# EAGLE design RAMPS_1-41 (EAGLE 6.3)
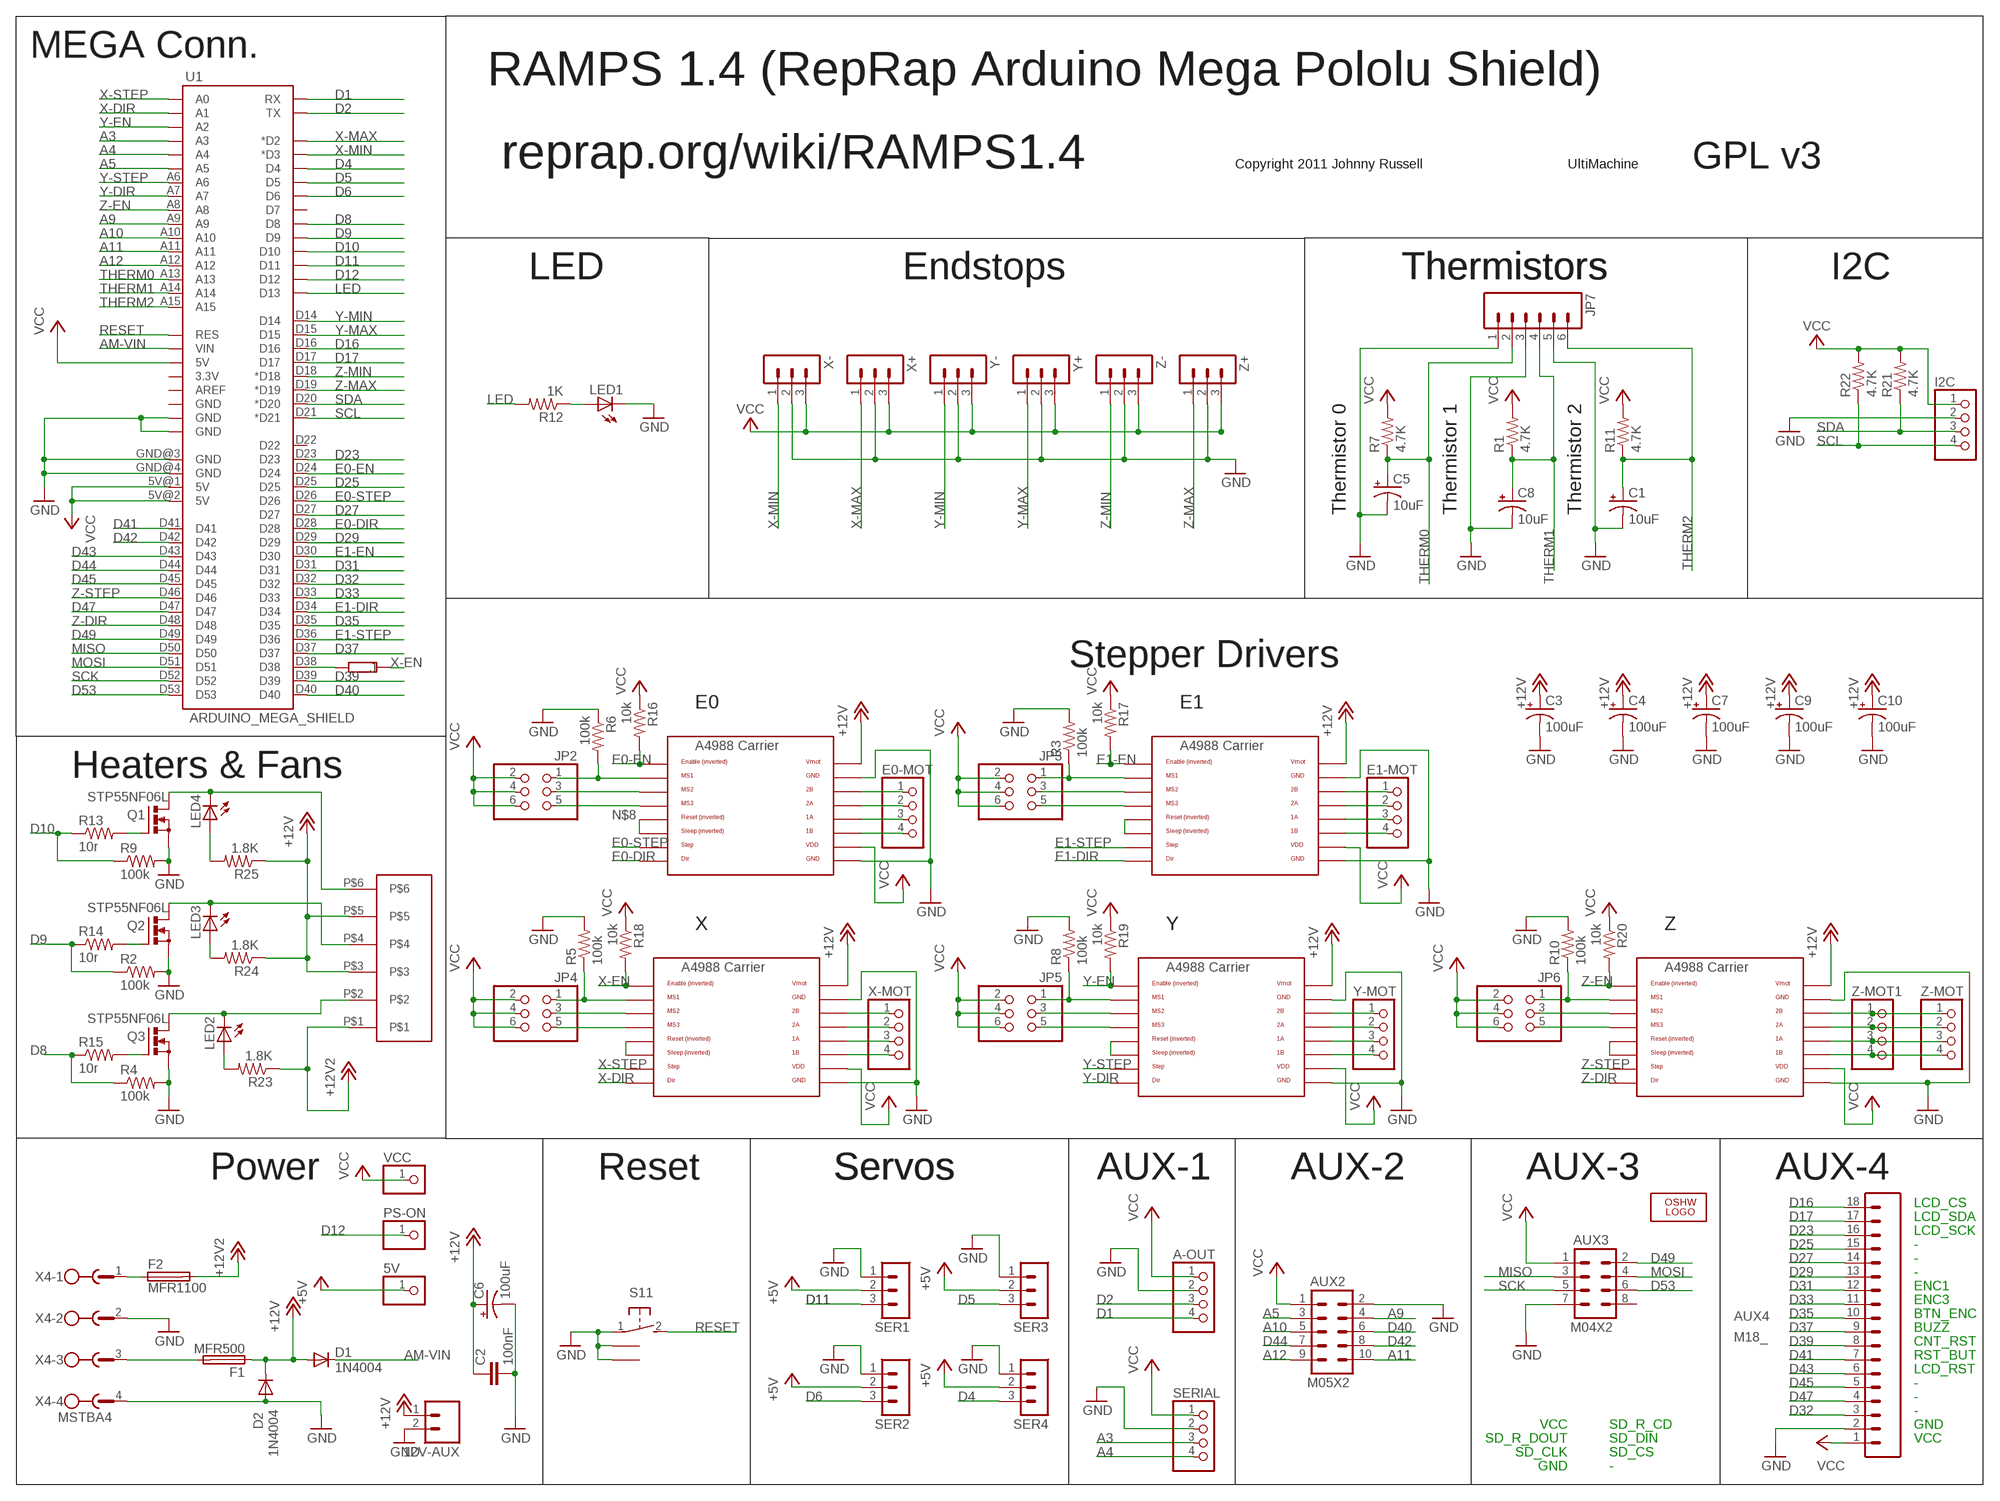
[diagram p0: schematic, sheet 1]

## Parts
5V  PINHD-1X1  [1X01]
12V-AUX  M02PTH  [1X02]
A-OUT  PINHD-1X4  [1X04]
AUX2  M05X2  [2X5]
AUX3  M04X2  [2X4]
AUX4  M18_  [1X18]
C1  10uF  CPOL-US153CLV-0405  [153CLV-0405]
C2  100nF  C-EUC0805  [C0805]
C3  100uF  CPOL-US153CLV-0605  [153CLV-0605]
C4  100uF  CPOL-US153CLV-0605  [153CLV-0605]
C5  10uF  CPOL-US153CLV-0405  [153CLV-0405]
C6  100uF  CPOL-US153CLV-0605  [153CLV-0605]
C7  100uF  CPOL-US153CLV-0605  [153CLV-0605]
C8  10uF  CPOL-US153CLV-0405  [153CLV-0405]
C9  100uF  CPOL-US153CLV-0605  [153CLV-0605]
C10  100uF  CPOL-US153CLV-0605  [153CLV-0605]
D1  1N4004  [DO41-10]
D2  1N4004  [DO41-10]
E0-MOT  PINHD-1X4  [1X04]
E1-MOT  PINHD-1X4  [1X04]
F1  MFR500  PTCFUSE  [MFR500]
F2  MFR1100  PTCFUSEMFR1100  [MFR1100]
I2C  PINHD-1X4  [1X04]
J  R-EU_R1206W  [R1206W]
JP2  PINHD-2X3  [2X03]
JP3  PINHD-2X3  [2X03]
JP4  PINHD-2X3  [2X03]
JP5  PINHD-2X3  [2X03]
JP6  PINHD-2X3  [2X03]
JP7  M06SIP  [1X06]
LED1  LEDCHIP-LED0805  [CHIP-LED0805]
LED2  LEDCHIP-LED0805  [CHIP-LED0805]
LED3  LEDCHIP-LED0805  [CHIP-LED0805]
LED4  LEDCHIP-LED0805  [CHIP-LED0805]
LOGO1  OSHW_LOGO_6MILX0100-NT  [OSHW_6X100_NOTEXT]
PS-ON  PINHD-1X1  [1X01]
Q1  STP55NF06L  IRF512  [TO220BV]
Q2  STP55NF06L  IRF512  [TO220BV]
Q3  STP55NF06L  IRF512  [TO220BV]
R1  4.7K  R-US_R0805  [R0805]
R2  100k  R-US_R0805  [R0805]
R3  100k  R-US_R0805  [R0805]
R4  100k  R-US_R0805  [R0805]
R5  100k  R-US_R0805  [R0805]
R6  100k  R-US_R0805  [R0805]
R7  4.7K  R-US_R0805  [R0805]
R8  100k  R-US_R0805  [R0805]
R9  100k  R-US_R0805  [R0805]
R10  100k  R-US_R1206W  [R1206W]
R11  4.7K  R-US_R0805  [R0805]
R12  1K  R-US_R0805  [R0805]
R13  10r  R-US_R0805  [R0805]
R14  10r  R-US_M0805  [M0805]
R15  10r  R-US_R0805  [R0805]
R16  10k  R-US_R0805  [R0805]
R17  10k  R-US_R0805  [R0805]
R18  10k  R-US_R0805  [R0805]
R19  10k  R-US_R0805  [R0805]
R20  10k  R-US_R0805  [R0805]
R21  4.7K  R-US_R0603  [R0603]
R22  4.7K  R-US_R0603  [R0603]
R23  1.8K  R-US_R0805  [R0805]
R24  1.8K  R-US_R0805  [R0805]
R25  1.8K  R-US_R0805  [R0805]
S1  31-XX  [B3F-31XX]
SER1  3PIN-HEADER  [3PIN-HEADER]
SER2  3PIN-HEADER  [3PIN-HEADER]
SER3  3PIN-HEADER  [3PIN-HEADER]
SER4  3PIN-HEADER  [3PIN-HEADER]
SERIAL  PINHD-1X4  [1X04]
U1  ARDUINO_MEGA_SHIELD  [ARDUINO_MEGA_SHIELD]
U$2  282837-6  [282837-6]
U$4E0  A4988BREAKOUT  [A4988BREAKOUT]
U$5E1  A4988BREAKOUT  [A4988BREAKOUT]
U$6X  A4988BREAKOUT  [A4988BREAKOUT]
U$7Y  A4988BREAKOUT  [A4988BREAKOUT]
VCC  PINHD-1X1  [1X01]
X4  MSTBA4  [MSTBA4]
X+  3PIN-HEADER  [3PIN-HEADER]
X-  3PIN-HEADER  [3PIN-HEADER]
X-MOT  PINHD-1X4  [1X04]
Y+  3PIN-HEADER  [3PIN-HEADER]
Y-  3PIN-HEADER  [3PIN-HEADER]
Y-MOT  PINHD-1X4  [1X04]
Z  A4988BREAKOUT  [A4988BREAKOUT]
Z+  3PIN-HEADER  [3PIN-HEADER]
Z-  3PIN-HEADER  [3PIN-HEADER]
Z-MOT  PINHD-1X4  [1X04]
Z-MOT1  PINHD-1X4  [1X04]

## Nets
+5V: 5V.1 SER1.2 SER2.2 SER3.2 SER4.2
+12V: 12V-AUX.1 C2.1 C3.+ C4.+ C6.+ C7.+ C9.+ C10.+ D1.A D2.C F1.1 R24.1 R25.1 U$2.P$3 U$2.P$5 U$4E0.VMOT U$5E1.VMOT U$6X.VMOT U$7Y.VMOT Z.VMOT
+12V2: F2.2 R23.1 U$2.P$1
A3: SERIAL.3 U1.A3
A4: SERIAL.4 U1.A4
A5: AUX2.3 U1.A5
A9: AUX2.4 U1.A9
A10: AUX2.5 U1.A10
A11: AUX2.10 U1.A11
A12: AUX2.9 U1.A12
AM-VIN: D1.C U1.VIN
D1: A-OUT.4 U1.RX
D2: A-OUT.3 U1.TX
D4: SER4.3 U1.D4
D5: SER3.3 U1.D5
D6: SER2.3 U1.D6
D8: R4.1 R15.1 U1.D8
D9: R2.1 R14.1 U1.D9
D10: R9.1 R13.1 U1.D10
D11: SER1.3 U1.D11
D12: PS-ON.1 U1.D12
D16: AUX4.18 U1.D16
D17: AUX4.17 U1.D17
D23: AUX4.16 U1.D23
D25: AUX4.15 U1.D25
D27: AUX4.14 U1.D27
D29: AUX4.13 U1.D29
D31: AUX4.12 U1.D31
D32: AUX4.3 U1.D32
D33: AUX4.11 U1.D33
D35: AUX4.10 U1.D35
D37: AUX4.9 U1.D37
D39: AUX4.8 U1.D39
D40: AUX2.6 U1.D40
D41: AUX4.7 U1.D41
D42: AUX2.8 U1.D42
D43: AUX4.6 U1.D43
D44: AUX2.7 U1.D44
D45: AUX4.5 U1.D45
D47: AUX4.4 U1.D47
D49: AUX3.2 U1.D49
D53: AUX3.6 U1.D53
E0-DIR: U1.D28 U$4E0.DIR
E0-EN: R16.2 U1.D24 U$4E0.EN
E0-STEP: U1.D26 U$4E0.STEP
E1-DIR: U1.D34 U$5E1.DIR
E1-EN: R17.2 U1.D30 U$5E1.EN
E1-STEP: U1.D36 U$5E1.STEP
GND: 12V-AUX.2 A-OUT.2 AUX2.2 AUX3.7 AUX4.2 C1.- C2.2 C3.- C4.- C5.- C6.- C7.- C8.- C9.- C10.- D2.A I2C.2 JP7.1 JP7.3 JP7.5 LED1.C Q1.S Q2.S Q3.S R2.2 R3.2 R4.2 R5.2 R6.1 R8.2 R9.2 R10.2 S1.1(1:P) S1.3 S1.4 SER1.1 SER2.1 SER3.1 SER4.1 SERIAL.2 U1.GND@0(GND) U1.GND@1(GND) U1.GND@3(GND) U1.GND@4(GND) U$4E0.GND U$4E0.GND@0(GND) U$5E1.GND U$5E1.GND@0(GND) U$6X.GND U$6X.GND@0(GND) U$7Y.GND U$7Y.GND@0(GND) X4.2 X4.4 X+.2 X-.2 Y+.2 Y-.2 Z+.2 Z-.2 Z.GND Z.GND@0(GND)
LED: R12.2 U1.D13
MISO: AUX3.3 U1.D50
MOSI: AUX3.4 U1.D51
N$1: LED3.C Q2.D U$2.P$4
N$2: J.1 U1.D38
N$3: E0-MOT.1 U$4E0.2B
N$4: E0-MOT.2 U$4E0.2A
N$5: JP2.1 R6.2 U$4E0.MS1
N$6: JP2.5 U$4E0.MS3
N$7: LED4.C Q1.D U$2.P$6
N$8: U$4E0.RST U$4E0.SLP(SLEEP)
N$9: JP2.3 U$4E0.MS2
N$10: E0-MOT.3 U$4E0.1A
N$11: E0-MOT.4 U$4E0.1B
N$12: E1-MOT.1 U$5E1.2B
N$13: E1-MOT.2 U$5E1.2A
N$14: JP4.1 R5.1 U$6X.MS1
N$15: JP4.3 U$6X.MS2
N$16: E1-MOT.3 U$5E1.1A
N$17: JP5.3 U$7Y.MS2
N$18: E1-MOT.4 U$5E1.1B
N$19: JP4.5 U$6X.MS3
N$20: U$6X.RST U$6X.SLP(SLEEP)
N$21: U$6X.2B X-MOT.1
N$22: U$6X.2A X-MOT.2
N$23: U$7Y.RST U$7Y.SLP(SLEEP)
N$24: U$5E1.RST U$5E1.SLP(SLEEP)
N$25: JP3.1 R3.1 U$5E1.MS1
N$26: U$6X.1A X-MOT.3
N$27: U$6X.1B X-MOT.4
N$28: U$7Y.2B Y-MOT.1
N$29: U$7Y.2A Y-MOT.2
N$30: U$7Y.1A Y-MOT.3
N$31: JP5.5 U$7Y.MS3
N$32: LED2.A R23.2
N$33: JP5.1 R8.1 U$7Y.MS1
N$34: JP3.5 U$5E1.MS3
N$35: JP3.3 U$5E1.MS2
N$36: U$7Y.1B Y-MOT.4
N$37: JP6.3 Z.MS2
N$38: Z.RST Z.SLP(SLEEP)
N$39: JP6.5 Z.MS3
N$40: JP6.1 R10.1 Z.MS1
N$41: Z-MOT1.1 Z-MOT.1 Z.2B
N$42: Z-MOT1.2 Z-MOT.2 Z.2A
N$43: Z-MOT1.3 Z-MOT.3 Z.1A
N$44: Z-MOT1.4 Z-MOT.4 Z.1B
N$45: LED3.A R24.2
N$46: LED1.A R12.1
N$47: Q2.G R14.2
N$48: Q1.G R13.2
N$49: Q3.G R15.2
N$50: LED4.A R25.2
N$51: LED2.C Q3.D U$2.P$2
N$53: F2.1 X4.1
N$54: F1.2 X4.3
RESET: S1.2(1:S) U1.RES
SCK: AUX3.5 U1.D52
SCL: I2C.4 R22.1 U1.D21(*D21)
SDA: I2C.3 R21.1 U1.D20(*D20)
THERM0: C5.+ JP7.2 R7.1 U1.A13
THERM1: C8.+ JP7.4 R1.1 U1.A14
THERM2: C1.+ JP7.6 R11.1 U1.A15
VCC: A-OUT.1 AUX2.1 AUX3.1 AUX4.1 I2C.1 JP2.2 JP2.4 JP2.6 JP3.2 JP3.4 JP3.6 JP4.2 JP4.4 JP4.6 JP5.2 JP5.4 JP5.6 JP6.2 JP6.4 JP6.6 R1.2 R7.2 R11.2 R16.1 R17.1 R18.1 R19.1 R20.1 R21.2 R22.2 SERIAL.1 U1.5V@0(5V) U1.5V@1(5V) U1.5V@2(5V) U$4E0.VDD U$5E1.VDD U$6X.VDD U$7Y.VDD VCC.1 X+.3 X-.3 Y+.3 Y-.3 Z+.3 Z-.3 Z.VDD
X-DIR: U1.A1 U$6X.DIR
X-EN: J.2 R18.2 U$6X.EN
X-MAX: U1.D2(*D2) X+.1
X-MIN: U1.D3(*D3) X-.1
X-STEP: U1.A0 U$6X.STEP
Y-DIR: U1.A7 U$7Y.DIR
Y-EN: R19.2 U1.A2 U$7Y.EN
Y-MAX: U1.D15 Y+.1
Y-MIN: U1.D14 Y-.1
Y-STEP: U1.A6 U$7Y.STEP
Z-DIR: U1.D48 Z.DIR
Z-EN: R20.2 U1.A8 Z.EN
Z-MAX: U1.D19(*D19) Z+.1
Z-MIN: U1.D18(*D18) Z-.1
Z-STEP: U1.D46 Z.STEP
Unconnected: AUX3.8 U1.3.3V U1.AREF U1.D7 U1.D22 U1.GND@2(GND)

## Notes on the sheet
- MEGA Conn.
- RAMPS 1.4 (RepRap Arduino Mega Pololu Shield)
- reprap.org/wiki/RAMPS1.4 | Copyright 2011 Johnny Russell | UltiMachine | GPL v3
- LED | Endstops | Thermistors | Thermistors | I2C
- Thermistor 0 | Thermistor 1 | Thermistor 2
- Stepper Drivers
- E0 | E1
- Heaters & Fans
- X | Y | Z
- Power | Reset | Servos | Servos | AUX-1 | AUX-2 | AUX-3 | AUX-4
- LCD_CS
- LCD_SDA
- LCD_SCK
- -
- -
- -
- ENC1
- ENC3
- BTN_ENC
- BUZZ
- CNT_RST
- RST_BUT
- LCD_RST
- -
- -
- -
- VCC | SD_R_CD | GND
- SD_R_DOUT | SD_DIN | VCC
- SD_CLK | SD_CS
- GND | -

## Library data of the parts
5V PS-ON VCC = adafruit:PINHD-1X1: Pin header 1x1 for 0.1" spacing With round pins
12V-AUX = SparkFun:M02: Header 2 Standard 2-pin 0.1" header. Use with straight break away headers (SKU : PRT-00116), right angle break away headers (PRT-00553), swiss pins (PRT-00743), machine pins (PRT-00117), and female headers (PRT-00115). Molex polarized connector foot print use with SKU : PRT-08233 with associated crimp pins and housings.
A-OUT E0-MOT E1-MOT I2C SERIAL X-MOT Y-MOT Z-MOT Z-MOT1 = RepRapjr:PINHD-1X4: PIN HEADER
AUX2 = RepRapjr_o:M05X2
AUX3 = SparkFun:M04X2
AUX4 = SparkFun:M18
C1 C3-C10 = adafruit:CPOL-US: POLARIZED CAPACITOR, American symbol
C2 = resistor:C-EU: CAPACITOR, European symbol
D1 D2 = diode:1N4004: DIODE general purpose rectifier, 1 A
F1 F2 = RepRapjr:PTCFUSE: LITTLEFUSE Picofuse/slow Littlefuse
J = rcl:R-EU_: RESISTOR, European symbol
JP2-JP6 = eagle-ramps:PINHD-2X3: PIN HEADER
JP7 = SparkFun:M06
LED1-LED4 = led:LED: LED OSRAM: - CHIPLED LG R971, LG N971, LY N971, LG Q971, LY Q971, LO R971, LY R971 LH N974, LH R974 LS Q976, LO Q976, LY Q976 LO Q996 - Hyper CHIPLED LW Q18S LB Q993, LB Q99A, LB R99A - SideLED LS A670, LO A670, LY A670, LG A670, LP A670 LB A673, LV A673, LT A673, LW A673 LH A674 LY A675 LS A676, LA A676, LO A676, LY A676, LW A676 LS A679, LY A679, LG A679 - Hyper Micro SIDELED® LS Y876, LA Y876, LO Y876, LY Y876 LT Y87S - SmartLED LW L88C, LW L88S LB L89C, LB L89S, LG L890 LS L89K, LO L89K, LY L89K LS L896, LA L896, LO L896, LY L896 - TOPLED LS T670, LO T670, LY T670, LG T670, LP T670 LSG T670, LSP T670, LSY T670, LOP T670, LYG T670 LG T671, LOG T671, LSG T671 LB T673, LV T673, LT T673, LW T673 LH T674 LS T676, LA T676, LO T676, LY T676, LB T676, LH T676, LSB T676, LW T676 LB T67C, LV T67C, LT T67C, LS T67K, LO T67K, LY T67K, LW E67C LS E67B, LA E67B, LO E67B, LY E67B, LB E67C, LV E67C, LT E67C LW T67C LS T679, LY T679, LG T679 LS T770, LO T770, LY T770, LG T770, LP T770 LB T773, LV T773, LT T773, LW T773 LH T774 LS E675, LA E675, LY E675, LS T675 LS T776, LA T776, LO T776, LY T776, LB T776 LHGB T686 LT T68C, LB T68C - Hyper Mini TOPLED® LB M676 - Mini TOPLED Santana® LG M470 LS M47K, LO M47K, LY M47K Source: http://www.osram.convergy.de LUXEON: - LUMILED® LXK2-PW12-R00, LXK2-PW12-S00, LXK2-PW14-U00, LXK2-PW14-V00 LXK2-PM12-R00, LXK2-PM12-S00, LXK2-PM14-U00 LXK2-PE12-Q00, LXK2-PE12-R00, LXK2-PE12-S00, LXK2-PE14-T00, LXK2-PE14-U00 LXK2-PB12-K00, LXK2-PB12-L00, LXK2-PB12-M00, LXK2-PB14-N00, LXK2-PB14-P00, LXK2-PB14-Q00 LXK2-PR12-L00, LXK2-PR12-M00, LXK2-PR14-Q00, LXK2-PR14-R00 LXK2-PD12-Q00, LXK2-PD12-R00, LXK2-PD12-S00 LXK2-PH12-R00, LXK2-PH12-S00 LXK2-PL12-P00, LXK2-PL12-Q00, LXK2-PL12-R00 Source: www.luxeon.com KINGBRIGHT: KA-3528ASYC Source: www.kingbright.com
LOGO1 = OSHW:OSHW_LOGO_6MIL
Q1-Q3 = transistor-power:IRF512: N-CHANNEL MOS FET
R1-R12 R16-R25 = adafruit:R-US_: RESISTOR, American symbol
R13-R15 = resistor:R-US_: RESISTOR, American symbol
S1 = eagle-ramps:31-XX: OMRON SWITCH; MPN: B3F-3100; OC_FARNELL: 959704; OC_NEWARK: 36M3582
SER1-SER4 X+ X- Y+ Y- Z+ Z- = ultimachine:3PIN-HEADER: PIN HEADER
U1 = RepRapjr_o:ARDUINO_MEGA_SHIELD
U$2 = RepRapjr:282837-6
U$4E0 = e0:A4988BREAKOUT
U$5E1 = e1:A4988BREAKOUT
U$6X = x:A4988BREAKOUT
U$7Y = y:A4988BREAKOUT
X4 = con-phoenix-508:MSTBA4: PHOENIX
Z = z:A4988BREAKOUT

## Board
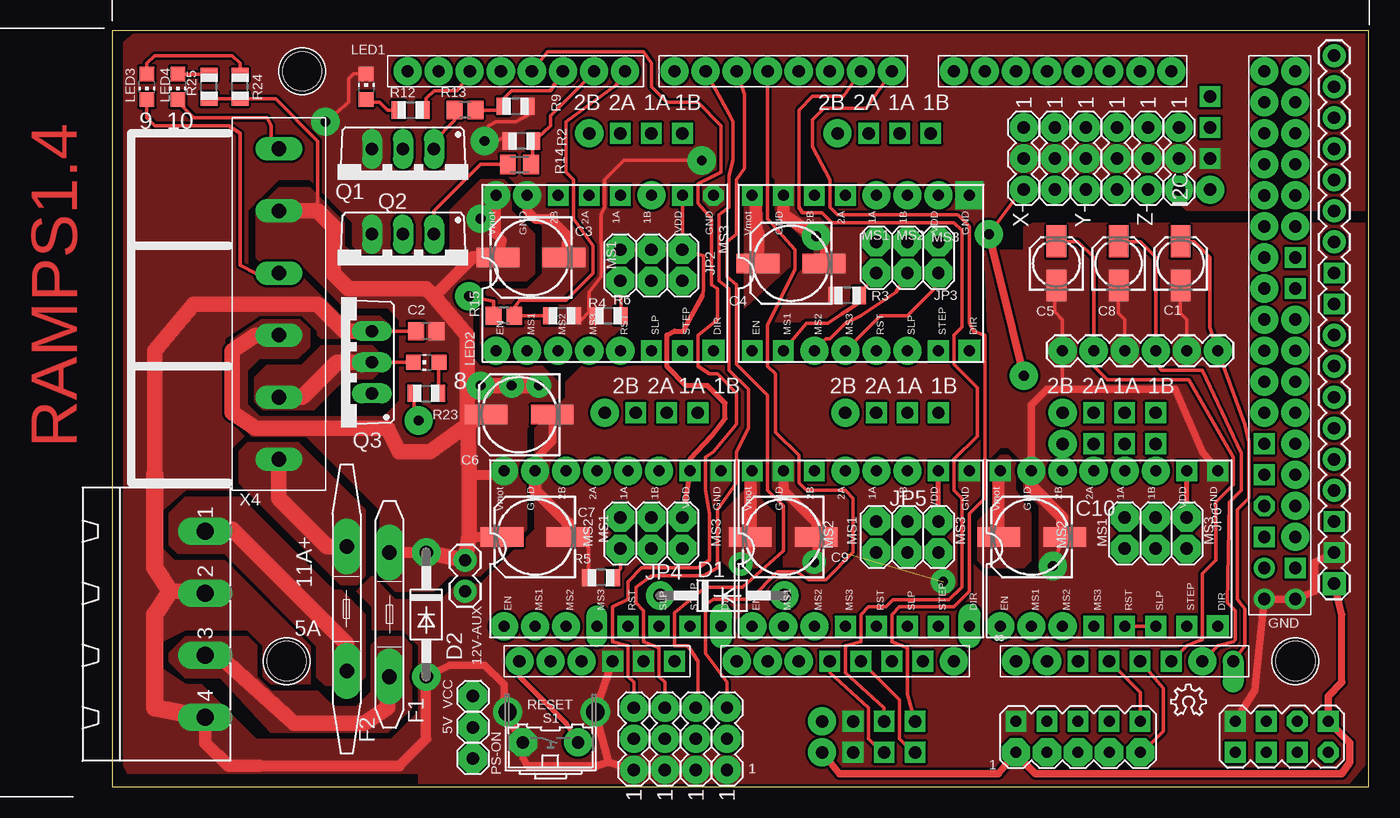
[diagram p1: board, top side]
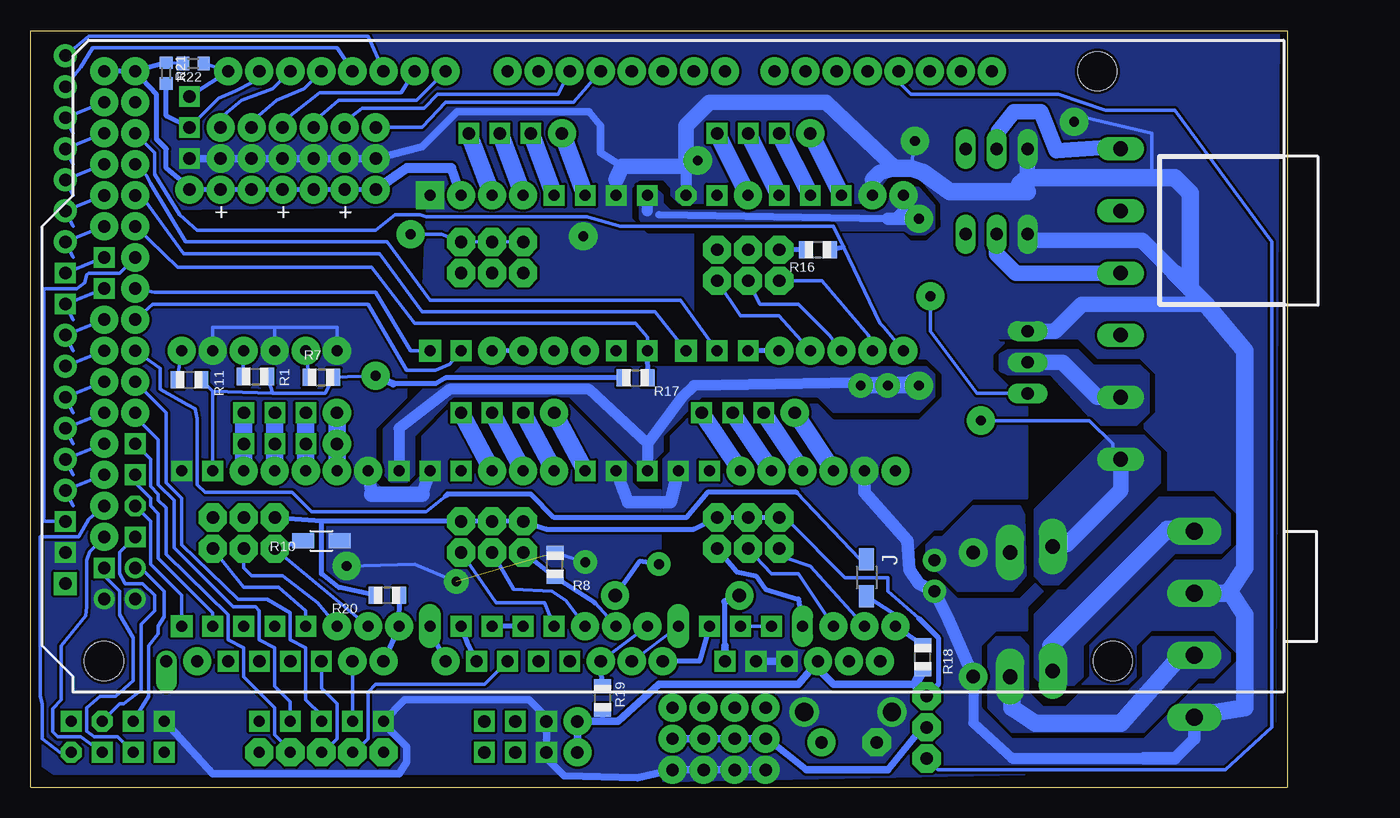
[diagram p2: board, bottom side, seen from below]

Size 102.86 x 61.9 mm. Coordinates in mm from the lower left corner, seen from the top.
Outline: 102.86,0 102.86,61.9 0,61.9 0,0 102.86,0
Copper layers (1*16): Top 0.035mm / dielectric 2mm / Bottom 0.035mm
Design rules "DesignRules": minimum track width 8mil, minimum drill 24mil, track to track 0.2mm, track to pad 0.2mm, pad to pad 8mil, via to via 8mil, smd to smd 8mil, copper to edge 10mil, drill to drill 8mil, minimum pad ring 0.3mm, minimum via ring 8mil, stop-mask expansion 4mil, vias tented up to drill 0mil, thermal gap 10mil

### Footprints (pad centres in the part's own frame; a part is rotated, then mirrored left to right if it is on the bottom)
1X01 = drill 1.016 pad 2.3 octagon: 1 0,0
1X02 = drill 1.016 pad 1.88: 1 0,0; 2 2.54,0
1X04 = drill 1.016 pad 2.3: 1 -2.54,0 | drill 1.016 pad 1.7 square: 2 0,0; 3 2.54,0; 4 5.08,0
2X5 = drill 0.9 pad 2.3 octagon: 1 -3.81,-1.27; 3 -1.27,-1.27; 5 1.27,-1.27; 7 3.81,-1.27; 9 6.35,-1.27 | drill 0.9 pad 1.7 square: 2 -3.81,1.27; 4 -1.27,1.27; 6 1.27,1.27; 8 3.81,1.27; 10 6.35,1.27
2X4 = drill 0.9 pad 1.7 square: 1 -3.81,-1.27; 4 -1.27,1.27; 5 1.27,-1.27; 6 1.27,1.27; 7 3.81,-1.27; 8 3.81,1.27 | drill 0.9 pad 1.7 octagon: 2 -3.81,1.27; 3 -1.27,-1.27
1X18 = drill 1.016 pad 1.88 square: 1 0,0 | drill 1.016 pad 1.7 square: 2 2.54,0; 3 5.08,0; 10 22.86,0; 11 25.4,0 | drill 1.016 pad 1.88: 4 7.62,0; 5 10.16,0; 6 12.7,0; 7 15.24,0; 8 17.78,0; 9 20.32,0; 12 27.94,0; 13 30.48,0; 14 33.02,0; 15 35.56,0; 16 38.1,0; 17 40.64,0; 18 43.18,0
153CLV-0405 = smd 2.6 x 1.6: + 1.8,0; - -1.8,0
C0805 = smd 1.3 x 1.5: 1 -0.85,0; 2 0.85,0
153CLV-0605 = smd 3.5 x 1.6: + 2.7,0; - -2.7,0
DO41-10 = drill 1.118 pad 2.3: A 5.08,0; C -5.08,0
MFR500 = drill 1.2 pad 2.3 long: 1 -5.08,0; 2 5.08,0
MFR1100 = drill 1.2 pad 2.3 long: 1 -5.08,0; 2 5.08,0
R1206W = smd 1.8 x 1.2: 1 -1.499,0; 2 1.499,0
2X03 = drill 1.016 pad 2.3 octagon: 1 -2.54,-1.27; 2 -2.54,1.27; 3 0,-1.27; 4 0,1.27; 5 2.54,-1.27; 6 2.54,1.27
1X06 = drill 0.9 pad 2.3: 1 0,0; 2 2.54,0; 3 5.08,0; 4 7.62,0; 5 10.16,0; 6 12.7,0
CHIP-LED0805 = smd 1.2 x 1.2: A 0,-1.05; C 0,1.05
TO220BV = drill 1.016 long: D 0,-2.54; G -2.54,-2.54; S 2.54,-2.54
R0805 = smd 1.1 x 1.4: 1 -1,0; 2 1,0
R0805' = smd 1.3 x 1.5: 1 -0.85,0; 2 0.85,0
M0805 = smd 1.3 x 1.6: 1 -0.95,0; 2 0.95,0
R0603 = smd 1 x 1.1: 1 -0.85,0; 2 0.85,0
B3F-31XX = drill 1.016 pad 2.3 octagon: 1 -2.261,-1.245 | drill 1.016 pad 2.3: 2 2.261,-1.245 | drill 1.499 pad 2.3: 3 -3.505,1.245; 4 3.664,1.245
3PIN-HEADER = drill 1.016 pad 2.3: 1 -2.54,0; 2 0,0; 3 2.54,0
ARDUINO_MEGA_SHIELD = drill 1 pad 2.3: 3.3V 35.56,2.54; 5V@0 38.1,2.54; 5V@1 93.98,50.8; 5V@2 96.52,50.8; A0 50.8,2.54; A1 53.34,2.54; A2 55.88,2.54; A7 68.58,2.54; A8 73.66,2.54; A9 76.2,2.54; A14 88.9,2.54; AREF 23.876,50.8; D2 58.42,50.8; D3 55.88,50.8; D4 53.34,50.8; D5 50.8,50.8; D6 48.26,50.8; D7 45.72,50.8; D8 41.656,50.8; D9 39.116,50.8; D10 36.576,50.8; D11 34.036,50.8; D12 31.496,50.8; D13 28.956,50.8; D14 68.58,50.8; D15 71.12,50.8; D16 73.66,50.8; D17 76.2,50.8; D18 78.74,50.8; D19 81.28,50.8; D20 83.82,50.8; D21 86.36,50.8; D22 93.98,48.26; D23 96.52,48.26; D24 93.98,45.72; D25 96.52,45.72; D26 93.98,43.18; D27 96.52,43.18; D28 93.98,40.64; D29 96.52,40.64; D30 93.98,38.1; D31 96.52,38.1; D32 93.98,35.56; D34 93.98,33.02; D36 93.98,30.48; D37 96.52,30.48; D38 93.98,27.94; D39 96.52,27.94; D40 93.98,25.4; D41 96.52,25.4; D42 93.98,22.86; D43 96.52,22.86; D45 96.52,20.32; D47 96.52,17.78; D49 96.52,15.24; D51 96.52,12.7; GND@2 26.416,50.8; RES 33.02,2.54; RX 63.5,50.8; TX 60.96,50.8 | drill 1 pad 1.7 square: A3 58.42,2.54; A4 60.96,2.54; A5 63.5,2.54; A6 66.04,2.54; A10 78.74,2.54; A11 81.28,2.54; A12 83.82,2.54; A13 86.36,2.54; D33 96.52,35.56; D35 96.52,33.02; D44 93.98,20.32; D46 93.98,17.78; D50 93.98,12.7; D53 96.52,10.16; GND@0 40.64,2.54; GND@1 43.18,2.54; VIN 45.72,2.54 | drill 1 pad 1.7 offset: A15 91.44,2.54 | drill 1 pad 1.7 octagon: D48 93.98,15.24 | drill 1 pad 1.7: D52 93.98,10.16; GND@3 93.98,7.62; GND@4 96.52,7.62 | hole 3.2: 96.52,2.54; 13.97,2.54; 15.24,50.8
282837-6 = drill 1.2 long: P$1 0,-12.7; P$2 0,-7.62; P$3 0,-2.54; P$4 0,2.54; P$5 0,7.62; P$6 0,12.7
A4988BREAKOUT = drill 0.9 pad 1.7 square: 1A 8.89,1.27; 2A 6.35,1.27; 2B 3.81,1.27; SLP 11.43,-11.43; STEP 13.97,-11.43; VDD 13.97,1.27 | drill 0.9 pad 2.3: 1B 11.43,1.27; EN -1.27,-11.43; GND@0 1.27,1.27; MS1 1.27,-11.43; MS2 3.81,-11.43; MS3 6.35,-11.43; RST 8.89,-11.43; VMOT -1.27,1.27 | drill 0.9 pad 1.8 square: DIR 16.51,-11.43 | drill 0.9 pad 1.7 octagon: GND 16.51,1.27
A4988BREAKOUT' = drill 0.9 pad 2.3: 1A 8.89,1.27; 1B 11.43,1.27; MS2 3.81,-11.43; MS3 6.35,-11.43; RST 8.89,-11.43; SLP 11.43,-11.43; VDD 13.97,1.27 | drill 0.9 pad 1.7 square: 2A 6.35,1.27; 2B 3.81,1.27; EN -1.27,-11.43; GND@0 1.27,1.27; MS1 1.27,-11.43; STEP 13.97,-11.43; VMOT -1.27,1.27 | drill 0.9 pad 1.8 square: DIR 16.51,-11.43 | drill 0.9 pad 2.3 square: GND 16.51,1.27
A4988BREAKOUT'' = drill 0.9 pad 2.3: 1A 8.89,1.27; 1B 11.43,1.27; 2A 6.35,1.27; 2B 3.81,1.27; EN -1.27,-11.43; GND@0 1.27,1.27; MS1 1.27,-11.43; MS2 3.81,-11.43; VMOT -1.27,1.27 | drill 0.9 pad 1.8 long: DIR 16.51,-11.43 | drill 0.9 pad 1.7 square: GND 16.51,1.27; RST 8.89,-11.43; SLP 11.43,-11.43; STEP 13.97,-11.43; VDD 13.97,1.27 | drill 0.9 pad 1.7 long: MS3 6.35,-11.43
A4988BREAKOUT''' = drill 0.9 pad 2.3: 1A 8.89,1.27; 1B 11.43,1.27; 2A 6.35,1.27; EN -1.27,-11.43; MS1 1.27,-11.43; MS2 3.81,-11.43 | drill 0.9 pad 1.7 square: 2B 3.81,1.27; GND 16.51,1.27; GND@0 1.27,1.27; MS3 6.35,-11.43; RST 8.89,-11.43; SLP 11.43,-11.43; STEP 13.97,-11.43; VDD 13.97,1.27; VMOT -1.27,1.27 | drill 0.9 pad 1.8 long: DIR 16.51,-11.43
MSTBA4 = drill 1.397 long: 1 -7.62,5.08; 2 -2.54,5.08; 3 2.54,5.08; 4 7.62,5.08
A4988BREAKOUT'''' = drill 0.9 pad 2.3: 1A 8.89,1.27; 1B 11.43,1.27; 2A 6.35,1.27; 2B 3.81,1.27; EN -1.27,-11.43; GND@0 1.27,1.27; MS1 1.27,-11.43; MS2 3.81,-11.43 | drill 0.9 pad 1.8 square: DIR 16.51,-11.43 | drill 0.9 pad 1.7 square: GND 16.51,1.27; MS3 6.35,-11.43; RST 8.89,-11.43; SLP 11.43,-11.43; STEP 13.97,-11.43; VDD 13.97,1.27; VMOT -1.27,1.27

### Placement (x,y rotation side)
5V  29.53,4.9 0 top
12V-AUX  28.89,18.57 270 top
A-OUT  60.64,5.4 0 top
AUX2  77.79,4.13 0 top
AUX3  95.73,4.13 180 top
AUX4  100.01,16.67 90 top
C1  87.44,42.86 90 top
C2  25.72,37.31 180 top
C3  34.29,43.34 180 top
C4  55.56,42.86 180 top
C5  77.28,42.86 90 top
C6  33.34,30.48 180 top
C7  34.61,20.48 180 top
C8  82.36,42.86 90 top
C9  54.93,20.48 180 top
C10  75.25,20.48 180 top
D1  49.94,15.69 0 top
D2  25.72,14.13 270 top
E0-MOT  41.59,53.5 0 top
E1-MOT  61.91,53.5 0 top
F1  22.7,14.13 270 top
F2  19.21,14.6 90 top
I2C  89.85,51.44 90 top
J  34.45,17.14 270 bottom
JP2  44.13,42.7 0 top
JP3  65.09,43.34 0 top
JP4  44.13,20.8 0 top
JP5  65.09,20.48 0 top
JP6  85.41,20.8 0 top
JP7  77.79,35.72 0 top
LED1  20.8,57.31 0 top
LED2  25.72,34.77 90 top
LED3  2.86,57.31 180 top
LED4  5.4,57.31 180 top
LOGO1  86.68,5.87 0 top
PS-ON  29.53,2.36 0 top
Q1  23.81,49.69 180 top
Q2  23.81,42.7 180 top
Q3  18.73,34.77 90 top
R1  84.45,33.6 0 bottom
R2  33.5,52.86 180 top
R3  60.16,40.23 180 top
R4  36.83,38.58 0 top
R5  40.01,17.14 180 top
R6  40.64,38.58 0 top
R7  79.06,33.54 0 bottom
R8  59.94,18.19 90 bottom
R9  33.02,55.72 0 top
R10  79.06,20.16 0 bottom
R11  89.85,33.34 0 bottom
R12  24.45,55.4 0 top
R13  10r  [R0805']  28.89,55.4 180 top
R14  33.34,50.96 180 top
R15  10r  [R0805']  32.07,38.58 180 top
R16  38.42,43.97 0 bottom
R17  53.34,33.5 0 bottom
R18  29.84,10.64 90 bottom
R19  56.04,7.3 90 bottom
R20  73.66,15.72 0 bottom
R21  91.76,58.42 90 bottom
R22  89.53,59.21 180 bottom
R23  25.72,32.23 0 top
R24  10.48,57.31 90 top
R25  7.94,57.31 90 top
S1  35.88,4.92 0 top
SER1  42.7,3.97 90 top
SER2  45.24,3.97 90 top
SER3  47.78,3.97 90 top
SER4  50.32,3.97 90 top
SERIAL  60.64,2.86 0 top
U1  0.32,7.78 0 top
U$2  13.65,39.53 0 top
U$4E0  32.7,47.15 0 top
U$5E1  A4988BREAKOUT  [A4988BREAKOUT']  53.66,47.15 0 top
U$6X  A4988BREAKOUT  [A4988BREAKOUT'']  33.34,24.61 0 top
U$7Y  A4988BREAKOUT  [A4988BREAKOUT''']  53.66,24.61 0 top
VCC  29.53,7.46 0 top
X4  2.54,13.34 270 top
X+  77.15,51.43 270 top
X-  74.61,51.43 270 top
X-MOT  42.86,30.64 0 top
Y+  82.23,51.43 270 top
Y-  79.69,51.43 270 top
Y-MOT  62.55,30.64 0 top
Z  A4988BREAKOUT  [A4988BREAKOUT'''']  73.98,24.61 0 top
Z+  87.31,51.43 270 top
Z-  84.77,51.43 270 top
Z-MOT  80.33,30.64 0 top
Z-MOT1  80.33,28.1 0 top

### Tracks (layer width: path | path; a pad name or v marks a point on that pad's centre or on a via)
+5V
  Bottom 0.61: SER4.2 SER3.2 SER2.2 | SER2.2 SER1.2 42.54,3.97 39.37,1.43 32.7,1.43 29.87,4.9 5V.1 | SER2.2
+12V  (via drill 0.8 pad 1.93, 0.8 pad 2, 0.8 pad 2.3)
  Top 0.305: R25.1 R24.1 13.38,56.31 16.83,52.86 16.83,47.15
  Top 0.406: C9.+ 52.23,19.37 v51.43,18.26
  Top 0.813: 29.21,20.48 C7.+ | U$6X.VMOT 32.07,25.56 29.53,25.56 29.21,25.56 | C3.+ 31.91,44.77 31.43,45.24 U$4E0.VMOT
  Top 0.914: F1.1 D2.C
  Top 1.016: C9.+ 52.23,25.4 U$7Y.VMOT | C10.+ 72.55,25.4 Z.VMOT | C4.+ 52.86,45.4 52.71,45.56 52.71,48.1 U$5E1.VMOT | C3.+ 29.53,43.34 26.51,40.32 26.19,40.32
  Top 1.27: 29.05,31.91 29.21,25.56 29.21,20.48 12V-AUX.1 D2.C | U$2.P$5 16.83,47.15 18.1,45.88 18.1,42.07 19.37,40.8 25.72,40.8 26.19,40.32 29.05,36.99 29.05,31.91 | 29.05,31.91 v30.16,32.86 v32.7,32.86 v34.93,32.86 | C6.+ 30.48,30.64 28.26,29.05 26.04,27.46 23.49,27.46 22.54,29.37 11.75,29.37 9.84,30.64 9.84,35.72 11.75,36.99 U$2.P$3
  Bottom 0.406: v51.43,18.26 53.02,18.47 D1.A
  Bottom 0.61: 32.7,46.51 51.43,46.83
  Bottom 0.914: U$4E0.VMOT 31.43,47.15 32.07,46.51 32.7,46.51 | 52.39,47.15 U$5E1.VMOT | Z.VMOT 72.71,29.37 68.58,32.54 57.15,32.54 52.39,28.1 | 52.39,28.1 U$7Y.VMOT | 52.39,28.1 49.53,31.91 48.58,32.86 30.77,33.18
  Bottom 1.016: 32.7,46.51 v30.16,46.51
  Bottom 1.27: U$6X.VMOT 32.07,25.56 | 30.77,33.18 30.77,33.15 v30.16,32.86 v34.93,32.86
  pour Top (no thermals): 21.91,22.7 21.91,17.3 23.18,16.03 26.35,16.03 27.62,17.3 30.16,17.3 33.97,21.11 33.97,29.37 36.51,31.91 36.51,33.18 35.24,34.45 30.16,34.45 29.53,35.08 29.53,40.8 30.16,41.43 33.97,41.43 34.61,42.07 34.61,45.24 32.7,47.15 32.7,49.05 32.07,49.69 30.16,49.69 27.62,47.15 27.62,43.66 26.99,43.02 20.32,43.02 19.05,44.29 19.05,46.2 16.19,49.05 13.65,49.05 11.75,47.15 11.75,43.34 12.38,42.7 15.56,42.7 19.05,39.21 22.54,39.21 23.49,38.26 23.49,31.59 22.22,30.32 12.07,30.32 11.11,31.27 11.11,34.13 12.07,35.08 15.24,35.08 16.19,36.04 16.19,37.47 15.4,38.26 12.22,38.26 9.68,36.51 9.84,30.32 11.43,28.73 15.88,28.73
  pour Bottom (no thermals): 28.89,33.81 28.89,31.91 30.16,30.64 37.15,30.64 38.42,31.91 47.94,31.91 51.12,28.73 51.12,27.46 52.39,26.19 53.02,26.19 58.74,31.91 68.26,31.91 71.44,28.73 71.44,25.56 72.07,24.92 73.34,24.92 73.98,25.56 73.98,29.37 70.17,33.18 68.9,33.18 67.63,34.45 29.53,34.45
  pour Top (no thermals): 51.75,24.92 51.75,24.29 49.85,22.38 49.85,18.57 50.48,17.94 53.02,17.94 54.29,19.21 54.29,22.38 53.02,23.65 53.02,24.92 52.39,25.56
  pour Top (no thermals): 72.07,26.51 72.07,23.02 70.8,21.75 70.8,18.57 71.44,17.94 74.61,17.94 75.25,18.57 75.25,22.38 73.98,24.29 73.98,26.51 73.34,27.15 72.71,27.15
  pour Top (no thermals): 51.75,49.05 51.75,39.21 55.56,42.7 55.56,44.61 53.02,47.15 53.02,48.42 52.39,49.05
  pour Bottom (no thermals): 28.89,45.72 28.89,47.62 30.16,49.05 32.07,49.05 32.7,48.42 32.7,47.78 33.34,47.15 50.48,47.15 51.12,47.78 51.12,48.42 51.75,49.05 52.39,49.05 53.02,48.42 53.02,46.51 52.39,45.56 31.43,45.56 30.8,45.24 29.69,45.24
  pour Bottom (no thermals): 21.59,22.38 21.43,17.3 22.54,16.03 26.99,16.03 29.53,18.57 29.53,19.84 28.89,20.48 28.26,20.48 25.72,23.02 21.91,23.02
+12V2  (via drill 0.8 pad 2.3)
  Top 0.305: F2.2 19.37,19.84 | R23.1 24.72,30.37 v25.08,30
  Top 1.27: U$2.P$1 13.65,23.65 17.62,19.68 F2.2
  Bottom 0.305: v25.08,30 16.19,30 14.29,28.1 14.29,27.46 U$2.P$1
  Bottom 1.27: U$2.P$1 13.65,24.29 18.1,19.84 19.37,19.84
  pour Top (no thermals): 10.48,27.46 10.48,24.92 18.73,16.67 20,16.67 20.64,17.3 20.64,22.7 15.24,28.1 11.11,28.1
  pour Bottom (no thermals): 10.48,27.46 10.48,24.92 18.73,16.67 20,16.67 20.64,17.3 20.64,22.7 14.61,28.73 11.75,28.73
A3
  Top 0.305: U1.A3 58.74,9.37 61.91,6.51 61.91,3.97 63.02,2.86 SERIAL.3
A4
  Top 0.305: U1.A4 64.45,7.14 64.45,3.97 65.56,2.86 SERIAL.4
A5
  Bottom 0.305: U1.A5 65.72,8.41 74.61,8.41 75.25,7.78 75.25,3.97 76.36,2.86 AUX2.3
A9
  Bottom 0.305: AUX2.4 U1.A9
A10
  Bottom 0.305: U1.A10 79.06,8.1 77.79,6.83 77.79,3.97 78.58,3.17 AUX2.5
A11
  Top 0.305: AUX2.10 84.14,7.78 U1.A11
A12
  Top 0.305: U1.A12 86.04,8.1 86.04,4.6 84.3,2.86 AUX2.9
AM-VIN
  Bottom 0.406: 46.04,11.59 46.04,15.19
  Bottom 0.61: 46.04,15.19 D1.C | U1.VIN 46.04,11.59
D1
  Top 0.305: U1.RX 61.75,55.56 58.26,55.56 57.31,54.61 57.31,52.39 58.74,49.69 58.74,47.47 59.37,46.83 69.21,46.83 70.17,45.88 70.17,37.94 70.49,37.31 71.44,36.99 71.44,23.65 70.17,22.38 70.17,16.03 68.9,14.76 64.45,14.76 63.82,14.13 63.82,11.91 65.09,11.43 65.09,7.62 A-OUT.4
D2
  Top 0.305: U1.TX 59.85,56.51 57.31,56.51 56.2,55.4 56.2,47.47 56.51,46.99 58.1,46.99 58.9,46.2 68.9,46.2 69.53,45.56 69.53,37.62 68.9,36.99 68.9,34.61 70.8,32.7 70.8,28.73 68.9,26.83 68.9,24.29 69.53,23.65 69.53,16.35 68.5,15.32 63.9,15.32 63.34,14.76 61.91,14.76 61.28,14.13 61.28,11.91 60.01,11.59 60.01,9.37 63.18,6.51 A-OUT.3
D4
  Top 0.305: U1.D4 53.66,46.51 55.88,43.97 55.88,42.39 53.66,37.78 53.66,34.45 54.29,33.81 54.29,29.05 56.2,27.15 56.2,24.92 56.83,24.29 60.01,24.29 60.64,23.65 60.64,19.21 58.42,16.99 56.99,16.99 56.04,17.62 54.45,17.62 52.23,15.4 49.21,15.4 48.58,14.92 48.58,10.95 50.32,8.57 SER4.3
D5
  Top 0.305: SER3.3 47.78,7.3 47.94,7.46 47.94,10.32 47.15,11.59 46.04,11.59 46.04,12.22 46.04,14.29 48.58,16.35 51.59,16.35 54.93,19.37 54.93,23.02 53.66,24.29 53.66,32.07 51.12,34.61 51.12,41.12 50.32,41.75 50.32,44.61 51.12,45.24 51.12,49.69 51.75,50.64 51.75,56.67 U1.D5
D6
  Top 0.305: U1.D6 50.48,55.09 50.8,54.45 50.8,51.28 50.48,50.01 50.48,47.47 49.69,46.83 49.69,41.43 50.48,40.8 50.48,34.13 52.07,32.54 52.07,29.37 51.12,27.46 51.12,24.92 49.53,22.7 49.53,17.94 48.42,17.3 44.13,17.3 42.86,16.35 42.86,15.08 43.5,14.45 43.5,11.91 44.77,11.43 44.77,9.05 45.24,8.57 SER2.3
D8
  Top 0.305: U1.D8 41.28,57.47 37.15,54.45 37.15,50.32 37.78,49.69 37.78,46.51 39.37,44.29 39.37,42.07 37.15,39.85 33.34,39.85 32.7,38.89 32.7,38.47 R15.1 R4.1
D9
  Top 0.305: U1.D9 39.21,58.26 35.88,54.93 35.88,54.13 35.24,53.5 R2.1 34.34,51.01 R14.1
D10
  Top 0.305: U1.D10 35.88,56.99 32.7,56.99 32.07,56.36 32.07,56.31 R9.1 31.75,55.4 R13.1
D11
  Top 0.305: SER1.3 42.7,8.57 42.23,9.05 42.23,11.59 40.96,11.91 40.96,14.76 42.23,15.4 42.23,16.83 43.34,17.94 47.94,17.94 48.9,18.57 48.9,22.38 48.58,24.29 48.58,26.99 49.21,27.46 51.12,29.69 51.12,32.23 49.53,33.81 48.9,33.81 47.94,34.45 47.94,36.99 49.53,38.26 49.53,40.8 49.05,41.12 49.05,46.51 47.94,47.78 47.94,49.37 49.85,50.32 49.85,54.13 47.94,56.04 45.4,56.04 44.13,57.31 44.13,59.21 43.5,60.17 35.62,60.17 U1.D11
D12
  Bottom 0.305: U1.D12 31.81,57.69 30.8,56.67 18.73,56.67 14.92,55.4 9.21,55.4 1.27,44.61 1.27,4.92 5.08,1.43 28.6,1.43 PS-ON.1
D16
  Bottom 0.305: AUX4.18 98.11,61.44 75.25,61.44 U1.D16
D17
  Bottom 0.305: U1.D17 77.79,60.48 97.79,60.48 98.74,58.9 AUX4.17
D23
  Bottom 0.305: U1.D23 AUX4.16 99.38,53.5
D25
  Bottom 0.305: U1.D25 AUX4.15 99.38,50.96
D27
  Bottom 0.305: U1.D27 AUX4.14 99.38,48.42
D29
  Bottom 0.305: U1.D29 AUX4.13 99.38,45.88
D31
  Bottom 0.305: U1.D31 AUX4.12 99.38,43.34
D32
  Bottom 0.305: AUX4.3 101.76,21.75 101.76,40.8 99.06,40.8 98.43,41.27 98.27,41.91 98.11,42.07 95.57,42.07 U1.D32
D33
  Bottom 0.305: AUX4.11 U1.D33
D35
  Bottom 0.305: U1.D35 AUX4.10 99.38,38.26
D37
  Bottom 0.305: U1.D37 AUX4.9 99.38,35.72
D39
  Bottom 0.305: AUX4.8 U1.D39
D40
  Bottom 0.305: U1.D40 91.76,30.64 91.76,24.92 90.57,23.73 90.49,23.65 90.49,19.84 85.88,15.4 83.5,15.4 81.6,14.29 81.6,12.06 80.33,11.43 80.33,7.14 79.06,5.87 AUX2.6
D41
  Bottom 0.305: U1.D41 AUX4.7 99.38,30.64
D42
  Bottom 0.305: U1.D42 94.3,30.32 92.39,28.42 92.39,24.76 91.12,23.49 91.12,19.59 86.3,14.76 84.46,14.76 84.14,14.45 84.14,12.06 82.87,11.43 82.87,8.25 81.6,6.98 AUX2.8
D43
  Bottom 0.305: U1.D43 AUX4.6 99.38,28.1
D44
  Bottom 0.305: AUX2.7 82.39,3.81 82.87,4.29 82.87,6.51 85.41,9.05 85.41,11.43 86.68,12.06 86.68,14.13 91.76,19.05 91.76,22.86 92.39,23.49 92.39,23.97 93.03,24.61 93.03,26.83 U1.D44
D45
  Bottom 0.305: U1.D45 AUX4.5 99.38,25.56
D47
  Bottom 0.305: U1.D47 AUX4.4 99.38,23.02
D49
  Bottom 0.305: AUX3.2 100.49,2.86 101.92,3.97 101.92,6.83 102.08,7.46 102.08,20.48 98.9,20.48 98.11,21.91 U1.D49
D53
  Bottom 0.305: U1.D53 96.84,17.3 95.57,16.03 95.57,14.13 94.46,12.22 94.46,8.73 95.88,7.46 97.16,7.46 98.27,6.51 98.27,4.6 97.63,4.12 95.72,4.12 AUX3.6
E0-DIR
  Bottom 0.305: U1.D28 93.82,48.42 90.33,43.66 74.3,43.66 70.8,38.89 51.75,38.89 U$4E0.DIR
E0-EN
  Bottom 0.305: U1.D24 92.71,51.91 92.71,50.16 90.65,46.83 89.22,45.56 74.61,45.56 73.02,46.83 70.96,46.83 70.49,46.67 57.31,46.67 54.61,45.88 37.15,45.88 36.34,44.21 33.34,37.94 33.02,37.62 U$4E0.EN
  Bottom 0.406: R16.2 36.34,44.21
E0-STEP
  Bottom 0.305: U1.D26 93.35,50.01 93.03,49.37 90.17,44.61 73.66,44.61 70.17,39.85 49.69,39.85 U$4E0.STEP
E1-DIR
  Bottom 0.305: U1.D34 92.71,40.48 91.12,40.48 74.61,40.48 71.76,35.72 U$5E1.DIR
E1-EN
  Bottom 0.305: U1.D30 90.8,42.54 74.93,42.54 71.44,37.94 53.34,37.94 52.39,36.83 U$5E1.EN
  Bottom 0.406: R17.2 U$5E1.EN
E1-STEP
  Bottom 0.305: U$5E1.STEP 68.58,34.61 69.69,34.13 72.07,34.13 75.25,39.53 92.87,39.53 U1.D36
GND  (via drill 0.8 pad 1.93, 0.8 pad 2, 0.8 pad 2.3)  (1 unrouted)
  Top 0.305: R9.2 34.34,55.13 33.02,54.45 31.43,54.45 30.8,54.13 v30.48,52.86 31.43,52.86 32.02,53.13 R2.2 | C3.- 37.51,43.13 | 39.05,38.89 R6.1 | 39.05,38.89 38.42,38.26 R4.2 | LED1.C 19.78,58.36 19.37,57.94 19.37,56.04 v17.46,54.45 | C5.- 77.15,40.93 77.15,38.89 77.79,38.26 JP7.1 77.79,32.54 | R5.2 39.01,19.57 38.73,20.48 C7.- | v76.99,18.1 77.79,20.32 C10.- | C8.- 82.36,38.77 82.87,38.26 JP7.3 | C1.- 87.44,38.77 87.95,38.26 JP7.5 | Q3.S C2.2 | 39.05,38.89 39.05,40.48 40.01,41.75 40.01,46.83 40.32,47.47 40.32,49.69 41.91,51.28 v48.26,51.28
  Top 0.61: Z.GND 89.22,27.46 86.99,32.54 77.79,32.54 76.52,32.54 75.25,31.27 Z.GND@0 | AUX3.7 93.5,7.94 U1.GND@3 U1.GND@4 98.43,16.03 98.43,18.41 AUX4.2 | AUX3.7 | 40.64,2.06 39.69,1.75 33.97,1.75 33.62,2.42 S1.1 32.07,6.19 32.07,8.41 30.48,10 27.62,10 D2.A | 58.1,45.4 58.26,43.81 C4.- 58.26,45.09 v57.63,45.08 | v57.47,18.41 57.63,18.73 C9.- | C6.- 36.04,28.26 34.61,26.83 34.61,25.56 U$6X.GND@0 | 40.64,2.06 S1.4 U1.GND@0 | 40.64,2.06 SER1.1
  Top 0.813: C3.- 37.31,45.08 35.88,46.51 34.61,46.51 33.97,47.15 U$4E0.GND@0 | C9.- 57.63,21.59 54.93,24.29 U$7Y.GND@0 | 23.49,1.75 25.72,3.97 D2.A
  Top 0.914: 12.07,1.75 23.49,1.75
  Top 1.016: C7.- 37.31,21.59 34.61,24.29 U$6X.GND@0 | Z.GND@0 75.25,24.61 77.79,22.07 77.79,20.64 C10.- | U$5E1.GND@0 54.93,46.83 56.83,45.56 58.1,45.4 | 12.07,1.75 9.52,1.75 7.62,3.65 X4.4 7.62,5.87
  Top 1.27: 4.76,16.03 7.46,16.03 | Q3.S 19.05,37.31 16.83,39.53 6.67,39.53 3.49,35.72 3.49,25.56
  Top 1.422: 3.49,25.56 3.49,17.94 4.76,16.03 3.49,14.13 3.49,6.51 7.46,5.71 X4.4 | 7.46,16.03 X4.2
  Bottom 0.305: 30.8,50.64 v30.48,52.86 | v17.46,54.45 16.51,54.77 11.11,53.5 11.11,49.85 | 77.79,36.04 JP7.1 77.79,37.62 82.87,37.62 | v68.01,16.83 71.44,18.26 v76.99,18.1 | 82.87,37.62 JP7.3 | 82.87,37.62 87.95,37.62 JP7.5 | 47.94,55.4 48.26,55.72 | R8.2 v57.47,18.41 | Z+.2
  Bottom 0.61: I2C.2 Z+.2 Z-.2 Y+.2 Y-.2 X+.2 X-.2 70.8,52.39 67.94,55.24 57.15,55.24 56.2,54.13 56.2,51.91 54.45,50.8 | U1.GND@0 U1.GND@1 | SER2.1 SER3.1 SER4.1 53.18,0.79 59.21,0.95 60.48,2.22 SERIAL.2 A-OUT.2 60.64,5.71 62.07,7.14 72.23,7.14 AUX2.2 73.5,4.92 73.5,4.76 72.07,3.33 72.07,2.06 72.71,1.11 87.95,1.11 91.44,4.92 AUX3.7 | SER2.1 | SER1.1 SER2.1 | v48.26,51.28 49.21,51.43
  Bottom 0.813: 20.8,44.77 20.64,44.61 | 54.93,49.69 U$5E1.GND@0 | 22.54,2.38 25.72,5.24 D2.A
  Bottom 0.914: 22.54,2.38 11.75,2.38 | 7.94,5.87 7.78,5.87 X4.4 | U$6X.GND@0 34.61,25.56 | 33.97,49.69 U$4E0.GND@0 | 49.21,50.8 U$4E0.GND | 21.11,49.85 21.75,49.85 | 21.27,48.74 21.11,50.16
  Bottom 1.016: 74.93,23.97 Z.GND@0 | 70.8,23.97 U$7Y.GND | 49.85,25.56 U$6X.GND 50.48,23.34 53.97,23.34 U$7Y.GND@0 | D2.A 27.78,13.81 12V-AUX.2 30.16,16.67 30.96,17.78 31.11,20.16 34.61,24.13 U$6X.GND@0 | 11.75,2.38 9.21,2.38 7.62,3.97 X4.4
  Bottom 1.27: 9.21,42.07 11.91,44.77 20.8,44.77 Q2.S | 70.8,23.97 74.93,23.97 | 33.97,49.69 33.34,50.32 32.07,50.64 37.78,56.04 47.31,56.04 47.94,55.4 49.21,54.13 49.21,51.43 49.21,50.8 54.45,50.8 54.93,49.69 | 6.67,39.53 16.83,39.53 19.05,37.31 Q3.S | Q1.S 21.3,52.2 21.3,50.06
  Bottom 1.422: 32.07,50.64 30.8,50.64 29.84,50.32 27.62,48.74 21.27,48.74 21.91,49.37 21.11,49.85 11.11,49.85 9.21,49.85 7.94,48.58 7.94,40.8 | 7.94,40.8 6.67,39.53 3.49,35.72 3.49,17.94 4.76,16.03 | 7.94,40.8 9.21,42.07 | 4.76,16.03 4.92,15.87 X4.2 | 7.3,5.87 3.49,6.51 3.49,14.13 4.76,16.03
  pour Bottom (no thermals): 0.95,1.43 0.64,63.02 44.45,62.87 44.77,47.78 33.97,47.78 33.34,49.05 32.07,50.64 30.8,50.64 28.42,47.78 28.26,36.67 17.14,36.67 15.56,35.08 12.07,35.08 10.79,33.81 10.79,30.64 11.75,29.69 11.75,29.37 9.84,27.46 9.84,24.29 6.03,24.29 4.13,22.38 4.13,19.84 5.4,18.57 9.21,18.57 16.19,11.59 16.19,9.05 16.83,8.41 13.02,8.41 12.38,9.05 12.38,11.59 11.11,12.86 6.03,12.86 4.13,10.95 4.13,10.32 6.03,8.41 7.3,8.41 11.75,3.97 22.54,3.97 22.54,1.11 1.27,1.11
  pour Bottom (no thermals): 19.37,1.11 19.05,3.65 22.54,3.97 25.08,6.51 25.08,11.59 23.81,12.86 21.27,12.86 21.27,14.76 20,16.03 20.64,16.67 21.91,15.4 26.99,15.4 28.26,16.67 29.53,16.67 30.8,17.94 30.8,19.21 28.89,21.11 28.26,21.11 25.72,23.65 21.27,23.65 21.27,32.86 22.86,32.86 24.13,34.13 24.13,35.4 23.18,36.35 23.49,36.35 24.13,36.99 26.35,45.88 28.26,45.88 29.53,44.61 30.8,44.61 31.43,45.24 50.48,45.24 50.32,34.92 29.53,35.08 28.26,33.81 28.26,31.91 30.16,30 37.15,30 38.42,31.27 47.94,31.27 50.48,28.73 50.48,27.46 51.12,26.83 51.12,0.48
  pour Bottom (no thermals): 40.32,61.6 101.12,61.75 102.71,60.01 102.71,47.15 70.48,47.47 71.12,33.81 69.53,33.81 68.26,35.08 48.58,35.08 48.58,45.24 52.39,45.24 53.66,46.51 53.66,49.05 53.02,49.69 51.12,49.69 50.48,49.05 50.48,48.42 49.85,47.78 40.32,47.78
  pour Bottom (no thermals): 51.12,1.11 51.28,21.59 51.28,24.29 53.02,24.29 53.66,24.92 53.66,26.19 58.74,31.27 68.26,31.27 70.8,28.73 70.8,25.56 72.07,24.29 73.98,24.29 74.61,24.92 74.61,29.37 72.07,31.91 72.07,43.97 72.71,44.61 73.98,44.61 72.71,43.66 89.85,43.66 93.03,46.51 101.6,46.51 101.92,1.75 100.96,1.11
  pour Top (no thermals): 0.95,1.75 0.95,60.96 1.9,61.75 102.71,61.75 102.71,47.15 87.95,47.15 87.31,47.78 75.25,47.78 73.98,46.51 73.98,44.61 70.8,44.61 70.8,40.16 54.29,40.16 56.52,42.39 57.15,42.39 57.47,42.7 57.47,43.97 54.29,47.15 54.29,49.69 53.66,50.32 51.12,50.32 51.12,40.16 44.13,40.16 38.1,33.81 36.51,33.81 35.24,35.08 30.8,35.08 30.16,35.72 30.16,40.16 30.8,40.8 33.97,40.8 35.24,42.07 35.24,45.88 33.34,47.78 33.34,49.05 32.07,50.32 30.16,50.32 26.99,47.15 26.99,43.97 26.67,43.66 20.32,43.66 19.68,44.29 19.68,46.2 16.19,49.69 13.65,49.69 11.11,47.15 11.11,42.7 11.75,42.07 15.56,41.75 18.73,38.58 21.91,38.58 22.54,37.94 22.54,37.62 21.59,36.67 17.14,36.67 16.83,36.99 16.83,37.31 15.56,38.58 12.07,38.58 9.21,36.67 9.21,30.32 10.79,28.73 9.84,27.78 9.84,24.29 6.03,24.29 3.81,22.38 3.81,19.84 5.08,18.57 9.21,18.57 16.19,11.59 16.19,8.41 13.02,8.41 12.38,9.05 12.38,11.59 11.11,12.86 6.03,12.86 4.13,11.91 4.13,9.68 6.03,8.41 7.3,8.41 11.75,3.97 22.86,3.97 25.08,6.19 25.72,6.51 25.72,1.11 1.27,1.11
  pour Top (isolate 0.254, no thermals): 37.78,37.94 70.8,38.26 70.8,45.88 59.69,45.88 58.1,41.12 50.8,38.26 51.12,49.05 46.67,49.05 46.04,48.42 37.78,48.42
  pour Top (no thermals): 49.05,0.16 47.94,17.3 69.53,16.99 69.53,17.94 70.17,18.57 71.44,17.3 102.71,16.03 102.71,2.06 101.12,0.16
  pour Top (no thermals): 25.08,0.16 25.08,11.59 23.81,12.86 21.27,12.86 21.27,14.76 20,16.03 21.27,17.3 23.18,15.4 26.99,15.4 28.26,16.67 30.16,16.67 34.61,21.11 34.61,29.37 37.15,31.91 37.15,33.18 38.42,34.45 71.75,34.77 71.44,43.97 74.61,43.97 74.61,45.88 75.41,46.2 102.87,46.2 102.71,14.76 75.88,14.76 75.88,23.02 74.61,24.29 74.61,26.51 73.34,27.78 72.71,27.78 71.44,26.51 71.44,23.02 70.17,21.75 70.17,15.08 54.93,14.76 54.93,23.02 53.66,24.29 53.66,26.19 53.02,26.83 51.12,26.83 51.12,24.92 49.21,23.02 49.05,0.16
LED
  Top 0.305: U1.D13 29.27,58.32 28.26,56.99 26.35,56.99 25.72,56.36 25.72,55.67 R12.2
MISO
  Bottom 0.305: U1.D50 95.57,19.21 95.57,17.46 95.09,16.67 93.66,16.67 92.71,15.72 92.71,14.45 93.82,13.33 93.82,7.94 95.25,6.83 95.57,6.83 AUX3.3
MOSI
  Bottom 0.305: AUX3.4 98.74,4.12 100.65,4.12 101.05,4.53 101.05,6.42 100.33,7.14 100.33,11.59 98.35,14.05 98.27,14.76 98.27,18.57 98.03,19.28 U1.D51
N$1
  Top 0.305: LED3.C 2.86,54.77 3.49,54.13 9.52,54.13 10.48,53.5 10.48,42.7 11.75,42.07 U$2.P$4
  Bottom 1.27: Q2.D 23.81,43.66 22.22,42.07 U$2.P$4
N$2
  Bottom 0.305: U1.D38 92.23,34.29 92.23,32.54 90.01,31.27 89.38,30.96 89.22,30.16 89.22,24.76 88.58,24.13 81.44,24.13 79.85,22.54 70.49,22.54 68.9,23.81 | J.1 35,18.64 40.16,24.13
  Bottom 0.406: 40.16,24.13 47.47,24.13 49.21,22.07 60.01,22.07 61.91,23.97 68.74,23.97 68.9,23.81
N$3
  Bottom 1.422: U$4E0.2B E0-MOT.1
N$4
  Bottom 1.422: U$4E0.2A E0-MOT.2
N$5
  Top 0.305: R6.2 41.64,41.07 JP2.1
  Bottom 0.305: U$4E0.MS1 34.29,36.99 38.1,41.43 JP2.1
N$6
  Bottom 0.305: U$4E0.MS3 41.59,38.58 44.77,38.58 JP2.5
N$7
  Top 0.305: LED4.C 5.4,56.04 6.67,54.77 12.7,54.77 13.02,54.13 13.02,52.86 U$2.P$6
  Bottom 1.27: 23.97,53.02 Q1.D 23.65,53.66 22.38,55.24 20.16,55.24 18.89,52.07 14.13,52.39 U$2.P$6
N$8
  Bottom 0.406: U$4E0.RST U$4E0.SLP
N$9
  Bottom 0.305: U$4E0.MS2 37.47,36.99 40.01,39.53 43.18,39.53 JP2.3
N$10
  Bottom 1.422: U$4E0.1A E0-MOT.3
N$11
  Bottom 1.422: U$4E0.1B E0-MOT.4
N$12
  Bottom 1.422: U$5E1.2B E1-MOT.1
N$13
  Bottom 1.422: U$5E1.2A E1-MOT.2
N$14
  Top 0.305: R5.1 41.59,17.89 JP4.1
  Bottom 0.305: U$6X.MS1 39.05,18.1 40.96,18.73 JP4.1
N$15
  Bottom 0.305: U$6X.MS2 40.01,17.46 42.23,17.46 JP4.3
N$16
  Bottom 1.422: U$5E1.1A E1-MOT.3
N$17
  Bottom 0.305: U$7Y.MS2 59.05,15.24 60.17,16.03 63.34,16.19 JP5.3
N$18
  Bottom 1.422: U$5E1.1B E1-MOT.4
N$19
  Bottom 0.406: JP4.5 45.08,17.62 43.5,17.3 42.7,16.19 40.01,15.4 U$6X.MS3
N$20
  Bottom 0.305: U$6X.RST U$6X.SLP
N$21
  Bottom 1.422: U$6X.2B X-MOT.1
N$22
  Bottom 1.422: X-MOT.2 U$6X.2A
N$23
  Bottom 0.406: U$7Y.RST U$7Y.SLP
N$24
  Bottom 0.406: U$5E1.RST U$5E1.SLP
N$25
  Top 0.305: U$5E1.MS1 56.83,37.94 58.58,37.94 59.62,38.67 60.96,39.53 R3.1 JP3.1
N$26
  Bottom 1.422: U$6X.1A X-MOT.3
N$27
  Bottom 1.422: U$6X.1B X-MOT.4
N$28
  Bottom 1.422: U$7Y.2B Y-MOT.1
N$29
  Bottom 1.422: U$7Y.2A Y-MOT.2
N$30
  Bottom 1.422: U$7Y.1A Y-MOT.3
N$31
  Bottom 0.305: U$7Y.MS3 60.8,15.08 64.77,15.08 JP5.5
N$32
  Top 0.305: R23.2 26.72,34.72 LED2.A
N$33
  Bottom 0.305: U$7Y.MS1 56.67,15.08
  Bottom 0.406: JP5.1 R8.1 56.67,15.08
N$34
  Top 0.305: JP3.5 67.31,40.8 65.09,38.58 62.86,38.58 U$5E1.MS3
N$35
  Top 0.305: JP3.3 64.14,40.48 61.28,38.58 60.01,37.94 58.74,36.67 58.42,36.67 U$5E1.MS2
N$36
  Bottom 1.422: U$7Y.1B Y-MOT.4
N$37
  Bottom 0.305: Z.MS2 79.38,15.08 82.23,17.3 84.77,17.3 85.41,17.94 JP6.3
N$38
  Top 0.305: Z.RST Z.SLP
N$39
  Bottom 0.305: Z.MS3 80.33,14.45 82.55,16.35 85.41,16.35 JP6.5
N$40
  Bottom 0.305: Z.MS1 JP6.1
  Bottom 0.406: R10.1 JP6.1
N$41
  Bottom 1.422: Z.2B Z-MOT1.1 Z-MOT.1
N$42
  Bottom 1.422: Z.2A Z-MOT1.2 Z-MOT.2
N$43
  Bottom 1.422: Z.1A Z-MOT1.3 Z-MOT.3
N$44
  Bottom 1.422: Z.1B Z-MOT1.4 Z-MOT.4
N$45
  Top 0.305: R24.2 10.48,59.21 9.84,59.85 3.49,59.85 2.86,59.21 LED3.A
N$46
  Top 0.305: R12.1 22.54,55.4 21.91,56.04 21.02,56.04 LED1.A
N$47
  Top 0.305: R14.2 30.16,50.96 26.35,47.15 Q2.G | Q2.G
N$48
  Top 0.305: R13.2 28.04,54.55 26.35,52.86 26.35,52.07 Q1.G
N$49  (via drill 0.8 pad 2.3)
  Top 0.305: R15.2 31.22,39.74 v29.21,40.16
  Bottom 0.305: v29.21,40.16 29.21,37.31 25.4,32.23 Q3.G
N$50
  Top 0.305: R25.2 5.45,58.31 LED4.A
N$51
  Top 0.305: LED2.C 22.22,34.77 21.91,34.45 21.59,34.45 Q3.D
  Top 1.27: U$2.P$2 15.56,31.91 18.42,34.77 Q3.D
  Bottom 1.27: U$2.P$2 15.56,31.91 18.42,34.77 Q3.D
  pour Top (no thermals): 11.75,33.5 11.75,31.59 12.38,30.96 16.51,30.96 19.05,33.5 21.27,33.5 21.91,34.13 21.91,35.4 21.27,36.04 17.14,36.04 15.56,34.45 12.7,34.45
  pour Bottom (no thermals): 11.43,33.81 11.43,30.64 12.38,29.69 15.56,29.69 19.37,33.81 22.86,33.81 23.49,34.13 23.49,35.4 22.86,35.72 17.14,35.72 15.88,34.45 12.07,34.45
N$53
  Top 1.27: X4.1 7.78,21.11 9.84,21.11 19.21,11.75 F2.1
  Bottom 1.422: 9.84,21.11 7.94,21.11 | 9.84,21.11 19.37,11.59 19.37,9.68 | 9.84,21.11 9.68,20.95 X4.1
  pour Bottom (no thermals): 4.76,22.38 4.76,19.84 5.4,19.21 9.21,19.21 16.83,11.59 16.83,9.05 17.46,8.41 20,8.41 20.64,9.05 20.64,14.13 18.73,16.03 18.1,16.03 10.48,23.65 6.03,23.65
  pour Top (no thermals): 4.76,22.38 4.76,19.84 5.4,19.21 9.21,19.21 16.83,11.59 16.83,9.05 17.46,8.41 20,8.41 20.64,9.05 20.64,14.13 18.73,16.03 18.1,16.03 10.48,23.65 6.03,23.65
N$54
  Top 1.27: X4.3 8.73,10.79 14.92,5.24 20.64,5.24 22.54,6.51 22.54,8.89 F1.2
  Bottom 1.422: 7.94,10.95 8.57,10.95 13.65,5.24 20.64,5.24 22.54,6.51 22.54,9.05
  pour Bottom (no thermals): 4.76,10.95 4.76,10.32 6.03,9.05 7.3,9.05 11.75,4.6 22.54,4.6 24.45,6.51 24.45,11.59 23.81,12.22 21.91,12.22 21.27,11.59 21.27,7.78 20,6.51 18.1,6.51 16.83,7.78 13.02,7.78 11.75,9.05 11.75,11.59 11.11,12.22 6.03,12.22
  pour Top (no thermals): 4.76,10.95 4.76,10.32 6.03,9.05 8.89,9.05 13.02,4.6 22.54,4.6 24.45,6.51 24.45,11.59 23.81,12.22 21.91,12.22 21.27,11.59 21.27,7.78 20,6.51 18.1,6.51 16.83,7.78 13.02,7.78 11.75,9.05 11.75,11.59 11.11,12.22 6.03,12.22
RESET
  Top 0.406: U1.RES 33.34,9.05 37.15,5.24 S1.2
SCK
  Bottom 0.305: AUX3.5 93.19,7.46 93.19,11.59 92.39,12.54 92.39,13.18 91.92,13.97 91.92,16.03 93.66,17.78 U1.D52
SCL
  Top 0.305: 90.01,56.51 I2C.4
  Bottom 0.305: I2C.4 88.11,57.63 U1.D21 R22.1
SDA
  Bottom 0.305: I2C.3 87.47,56.36 86.04,56.99 84.77,57.63 U1.D20
  Bottom 0.406: I2C.3 91.76,54.93 R21.1
THERM0
  Top 0.305: U1.A13 87.95,11.59 88.74,11.91 89.22,12.06 89.22,17.46 90.33,18.57 90.33,23.34 91.76,24.76 91.76,26.99 88.11,33.34 81.44,33.34 80.33,34.45 JP7.2 80.33,43.34 79.06,44.61 77.33,44.61 C5.+
  Bottom 0.305: R7.1 JP7.2
THERM1
  Top 0.305: U1.A14 90.49,11.59 91.76,11.91 91.92,12.06 91.92,14.45 91.28,15.08 91.44,23.34 92.39,24.29 92.39,27.3 89.22,34.13 85.88,34.13 85.41,34.92 JP7.4 85.41,43.34 84.14,44.61 82.41,44.61 C8.+
  Bottom 0.305: R1.1 JP7.4
THERM2
  Top 0.305: U1.A15 92.71,11.59 92.71,14.6 92.07,15.4 92.07,22.7 93.03,23.65 93.03,28.26 92.71,29.69 JP7.6 | JP7.6 90.33,35.88 | C1.+ 87.49,44.61 88.58,44.61 89.85,43.34 89.85,37.62 JP7.6
  Bottom 0.305: R11.1 JP7.6
VCC  (via drill 0.8 pad 2.3)
  Top 0.305: AUX2.1 74.14,2.86 | v71.76,45.24 74.45,48.89 X-.3 | 48.31,40.21 48.42,40.64 48.42,43.5 JP2.6 U$4E0.VDD
  Top 0.406: JP6.2 JP6.4 JP6.6 Z.VDD | JP2.2 JP2.4 JP2.6 | JP5.6 U$7Y.VDD | JP4.6 47.31,25.56 U$6X.VDD 47.31,26.83 49.05,28.73 50.16,30.16 50.16,31.43 48.74,32.86 46.99,32.86 45.4,34.45 45.4,36.99 46.04,37.31 46.72,37.31 48.31,40.21
  Top 0.559: AUX4.1 100.65,14.13 100.65,8.57
  Top 0.61: 100.65,8.57 99.54,7.46 AUX3.1 101.28,3.65 101.28,2.06 100.65,1.11 75.57,1.11 73.98,2.7 AUX2.1 72.55,1.11 59.53,1.11 SERIAL.1 | v71.76,45.24 v74.61,33.65
  Bottom 0.305: JP3.2 JP3.4 JP3.6 69.21,45.24 v71.76,45.24 | 30.16,13.81 32.7,16.03 32.7,17.14 36.19,17.14 40.8,21.75 JP4.2 | Z.VDD 87.95,32.38 | 87.95,32.38 83.03,32.23 | 83.03,32.23 78.74,32.23 R7.2 v74.61,33.65 | R11.2 87.95,32.38 | R1.2 83.03,32.23 | R22.2 R21.2 | I2C.1
  Bottom 0.406: I2C.1 Z+.3 Z-.3 Y+.3 Y-.3 X+.3 X-.3 | JP4.2 JP4.4 JP4.6 48.58,21.11 60.64,21.11 JP5.2 JP5.4 JP5.6 79.06,21.75 | U1.5V@1 U1.5V@2 | 89.85,49.05 91.76,50.64 91.76,52.23 92.55,53.02 92.55,56.67 U1.5V@1 | 79.06,21.75 JP6.2 | 30.16,13.81 28.58,12.22 28.58,8.41 VCC.1 | R20.1 77.63,16.35 79.06,17.46 79.06,21.75 | R19.1 56.04,5.4 | R17.1 68.9,33.5 69.69,33.02 73.18,33.02 | R16.1 JP2.2 | R21.2 U1.5V@1
  Bottom 0.61: I2C.1 89.85,49.05 | SERIAL.1 A-OUT.1 56.04,5.4 54.77,5.4 51.43,8.41 40.01,8.41 U1.5V@0 38.42,9.68 37.15,8.41 30.48,8.41 | VCC.1 29.84,7.46 | 73.18,33.02 v74.61,33.65
  Bottom 0.813: U$5E1.VDD 68.42,50.64 72.07,50.64 X-.3 | VCC.1 30.48,8.41 R18.1
X-DIR
  Bottom 0.254: U$6X.DIR U1.A1
X-EN
  Bottom 0.305: U$6X.EN 32.07,12.86 32.07,14.13 J.2
  Bottom 0.406: R18.2 U$6X.EN
X-MAX
  Bottom 0.305: X+.1 77.15,54.45 75.72,55.56 70.64,55.56 69.53,56.67 59.69,56.67 U1.D2
X-MIN
  Bottom 0.305: X-.1 72.07,53.97 70.8,53.97 68.9,56.04 58.42,56.04 U1.D3
X-STEP
  Bottom 0.406: U$6X.STEP 48.1,10.32 U1.A0
Y-DIR
  Bottom 0.305: U1.A7
  Bottom 0.406: U1.A7 69.53,11.59 U$7Y.DIR
Y-EN
  Bottom 0.305: U$7Y.EN U1.A2
  Bottom 0.406: R19.2 U1.A2
Y-MAX
  Bottom 0.305: Y+.1 82.23,54.45 79.22,56.83 72.55,56.83 U1.D15
Y-MIN
  Bottom 0.305: Y-.1 79.69,54.45 77.63,56.2 71.28,56.2 U1.D14
Y-STEP
  Bottom 0.305: U1.A6
  Bottom 0.406: U1.A6 66.99,11.59 U$7Y.STEP
Z-DIR
  Bottom 0.305: Z.DIR 90.49,15.72 93.03,18.26 93.03,21.75 U1.D48
Z-EN
  Bottom 0.406: R20.2 Z.EN U1.A8
Z-MAX
  Bottom 0.305: Z+.1 87.31,54.77 85.57,56.2 83.03,57.15 U1.D19
Z-MIN
  Bottom 0.305: Z-.1 84.77,54.45 82.71,56.2 80.49,57.15 U1.D18
Z-STEP
  Bottom 0.305: Z.STEP 87.95,14.29 92.39,18.73 92.39,22.38 93.03,23.02 93.03,23.65 94.14,24.76 U1.D46
(copper drawn outside any net)
  shapes: Bottom circle x1

### Text on the board
Top: RAMPS1.4
tNames: 2B | 2A | 1A | 1B | 2B | 2A | 1A | 1B | 9 | 10 | MS1 | MS2 | MS3 | MS3 | MS1 | 8 | 2B | 2A | 1A | 1B | 2B | 2A | 1A | 1B | 2B | 2A | 1A | 1B | MS2 | MS1 | MS3 | MS2 | MS1 | MS3 | MS2 | MS1 | MS3 | 11A+ | 5A | GND | 8 | RESET | 1 | 1
bNames: + | + | + | +
Document: RAMPS 1.4 (RepRap Arduino MEGA Pololu Shield) | GPL v3 | reprap.org/wiki/RAMPS1.4 | Endstops | Reversing input power, and inserting stepper drivers incorrectly will destroy electronics. | I2C | 21 | 20 | GND | 12-35V Out | 5V | - | D10 | + | AUX-4 | D16 | - | D17 | D9 | + | D23 | D25 | - | D27 | D11 | + | D29 | D31 | 12-35VDC In | D33 | D35 | + | 11A | D37 | - | D38 | D41 | + | 5A | D43 | - | D45 | SERVOS | AUX-1 | AUX-2 | AUX-3 / SPI | D47 | D11 | D6 | D5 | D4 | D32 | A9 | A11 | SCK | MISO | 5V | GND | D2 | D1 | GND | D63 | D48 | D42 | D65 | GND | D52 | D50 | 5V | 5V | 5V | 5V | 5V | GND | 5V | GND | A3 | A4 | 5V | A5 | A10 | D44 | A12 | NC | D53 | MOSI | D49 | 5V | D57 | D58 | D59 | D64 | D66 | D51 | GND | GND | GND | GND | Copyright 2011 Johnny Russell - UltiMachine
_tsilk: + | I2C | END STOPS | 21 | + | E0 | 1 | S | 20 | D10 | 1 | - | - | E1 | + | + | + | D9 | T0 | T1 | T2 | + | 1 | + | D8 | 1 | 1 | 1 | U | X | Y | Z | + | + | - | 1 | + | PS | AUX-4 | AUX-1 | AUX-2 | AUX-3 | + | - | s | s | 1 | - | + | UltiMachine | GPL3 | 1 | SERVOS | 1 | reprap.org/wiki/RAMPS | V1.4 | -